# EAGLE design inputsheild_7 (EAGLE 9.3.0)
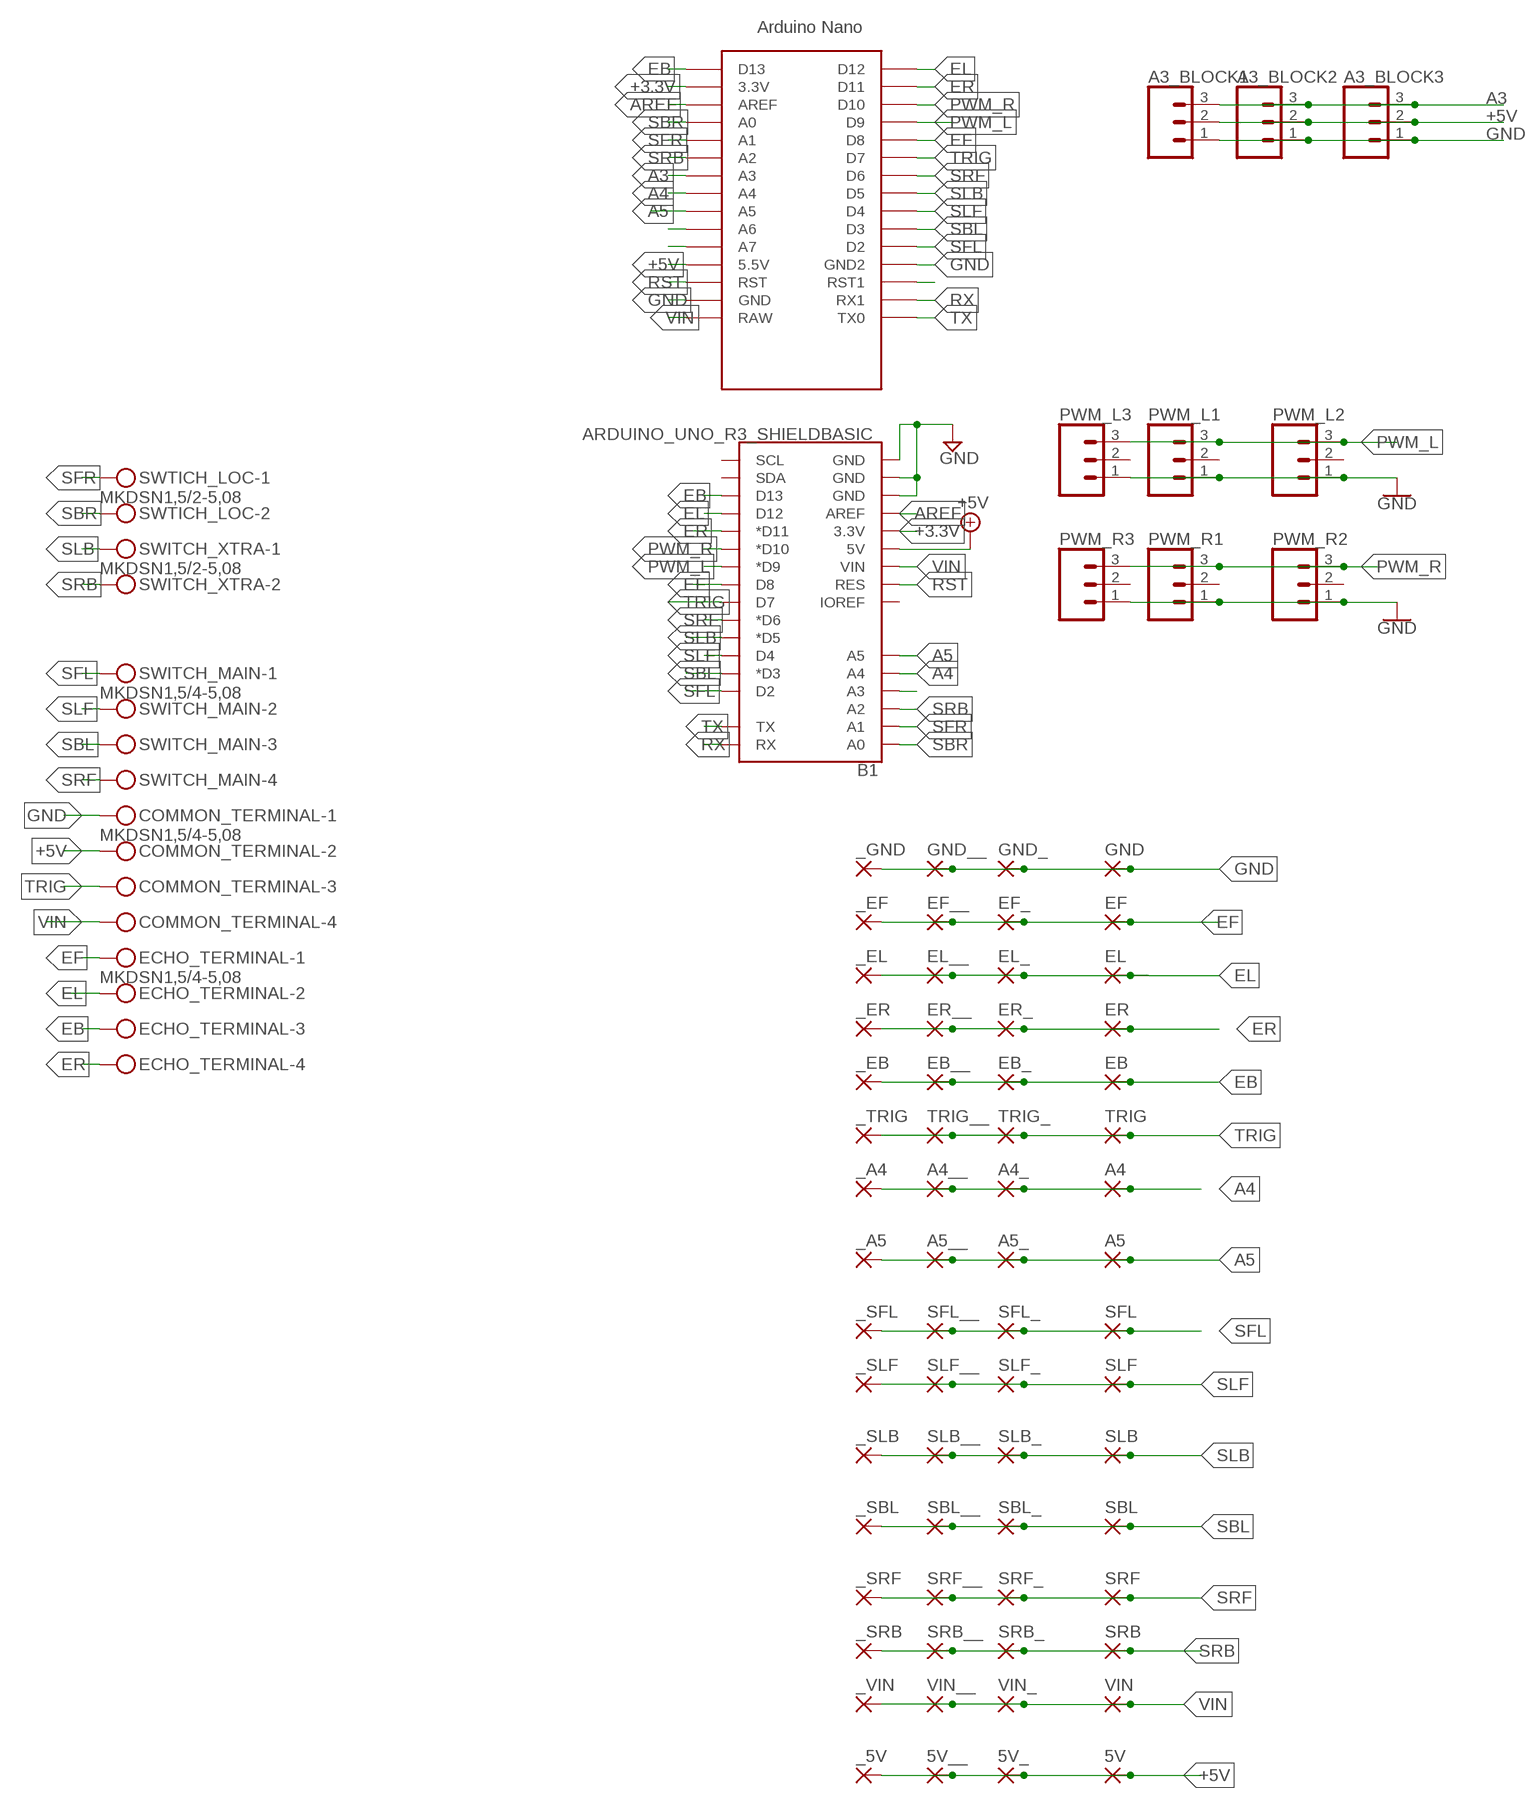
[diagram p0: schematic, sheet 1]

## Parts
5V  SMD5  [SMD2,54-5,08]
5V_  SMD5  [SMD2,54-5,08]
5V__  SMD5  [SMD2,54-5,08]
_5V  SMD5  [SMD2,54-5,08]
_A4  SMD5  [SMD2,54-5,08]
_A5  SMD5  [SMD2,54-5,08]
_EB  SMD5  [SMD2,54-5,08]
_EF  SMD5  [SMD2,54-5,08]
_EL  SMD5  [SMD2,54-5,08]
_ER  SMD5  [SMD2,54-5,08]
_GND  SMD5  [SMD2,54-5,08]
_SBL  SMD5  [SMD2,54-5,08]
_SFL  SMD5  [SMD2,54-5,08]
_SLB  SMD5  [SMD2,54-5,08]
_SLF  SMD5  [SMD2,54-5,08]
_SRB  SMD5  [SMD2,54-5,08]
_SRF  SMD5  [SMD2,54-5,08]
_TRIG  SMD5  [SMD2,54-5,08]
_VIN  SMD5  [SMD2,54-5,08]
A3_BLOCK1  CONN_03  [1X03]
A3_BLOCK2  CONN_03  [1X03]
A3_BLOCK3  CONN_03  [1X03]
A4  SMD5  [SMD2,54-5,08]
A4_  SMD5  [SMD2,54-5,08]
A4__  SMD5  [SMD2,54-5,08]
A5  SMD5  [SMD2,54-5,08]
A5_  SMD5  [SMD2,54-5,08]
A5__  SMD5  [SMD2,54-5,08]
B1  ARDUINO_UNO_R3_SHIELDBASIC  [UNO_R3_SHIELD]
COMMON_TERMINAL  MKDSN1,5/4-5,08  [MKDSN1,5/4-5,08]
EB  SMD5  [SMD2,54-5,08]
EB_  SMD5  [SMD2,54-5,08]
EB__  SMD5  [SMD2,54-5,08]
ECHO_TERMINAL  MKDSN1,5/4-5,08  [MKDSN1,5/4-5,08]
EF  SMD5  [SMD2,54-5,08]
EF_  SMD5  [SMD2,54-5,08]
EF__  SMD5  [SMD2,54-5,08]
EL  SMD5  [SMD2,54-5,08]
EL_  SMD5  [SMD2,54-5,08]
EL__  SMD5  [SMD2,54-5,08]
ER  SMD5  [SMD2,54-5,08]
ER_  SMD5  [SMD2,54-5,08]
ER__  SMD5  [SMD2,54-5,08]
GND  SMD5  [SMD2,54-5,08]
GND_  SMD5  [SMD2,54-5,08]
GND__  SMD5  [SMD2,54-5,08]
PWM_L1  CONN_03  [1X03]
PWM_L2  CONN_03  [1X03]
PWM_L3  CONN_03  [1X03]
PWM_R1  CONN_03  [1X03]
PWM_R2  CONN_03  [1X03]
PWM_R3  CONN_03  [1X03]
SBL  SMD5  [SMD2,54-5,08]
SBL_  SMD5  [SMD2,54-5,08]
SBL__  SMD5  [SMD2,54-5,08]
SFL  SMD5  [SMD2,54-5,08]
SFL_  SMD5  [SMD2,54-5,08]
SFL__  SMD5  [SMD2,54-5,08]
SLB  SMD5  [SMD2,54-5,08]
SLB_  SMD5  [SMD2,54-5,08]
SLB__  SMD5  [SMD2,54-5,08]
SLF  SMD5  [SMD2,54-5,08]
SLF_  SMD5  [SMD2,54-5,08]
SLF__  SMD5  [SMD2,54-5,08]
SRB  SMD5  [SMD2,54-5,08]
SRB_  SMD5  [SMD2,54-5,08]
SRB__  SMD5  [SMD2,54-5,08]
SRF  SMD5  [SMD2,54-5,08]
SRF_  SMD5  [SMD2,54-5,08]
SRF__  SMD5  [SMD2,54-5,08]
SWITCH_MAIN  MKDSN1,5/4-5,08  [MKDSN1,5/4-5,08]
SWITCH_XTRA  MKDSN1,5/2-5,08  [MKDSN1,5/2-5,08]
SWTICH_LOC  MKDSN1,5/2-5,08  [MKDSN1,5/2-5,08]
TRIG  SMD5  [SMD2,54-5,08]
TRIG_  SMD5  [SMD2,54-5,08]
TRIG__  SMD5  [SMD2,54-5,08]
U$1  NANO  [NANO]
VIN  SMD5  [SMD2,54-5,08]
VIN_  SMD5  [SMD2,54-5,08]
VIN__  SMD5  [SMD2,54-5,08]

## Nets
+3.3V: B1.3.3V U$1.3.3V
+5V: 5V.1(P) 5V_.1(P) 5V__.1(P) _5V.1(P) A3_BLOCK1.2 A3_BLOCK2.2 A3_BLOCK3.2 B1.5V COMMON_TERMINAL.2 U$1.5V(5.5V)
A3: A3_BLOCK1.3 A3_BLOCK2.3 A3_BLOCK3.3 U$1.A3
A4: _A4.1(P) A4.1(P) A4_.1(P) A4__.1(P) B1.A4 U$1.A4
A5: _A5.1(P) A5.1(P) A5_.1(P) A5__.1(P) B1.A5 U$1.A5
AREF: B1.AREF U$1.AREF
EB: _EB.1(P) B1.D13 EB.1(P) EB_.1(P) EB__.1(P) ECHO_TERMINAL.3 U$1.D13
EF: _EF.1(P) B1.D8 ECHO_TERMINAL.1 EF.1(P) EF_.1(P) EF__.1(P) U$1.D8
EL: _EL.1(P) B1.D12 ECHO_TERMINAL.2 EL.1(P) EL_.1(P) EL__.1(P) U$1.D12
ER: _ER.1(P) B1.D11(*D11) ECHO_TERMINAL.4 ER.1(P) ER_.1(P) ER__.1(P) U$1.D11
GND: _GND.1(P) A3_BLOCK1.1 A3_BLOCK2.1 A3_BLOCK3.1 B1.GND@0(GND) B1.GND@1(GND) B1.GND@2(GND) COMMON_TERMINAL.1 GND.1(P) GND_.1(P) GND__.1(P) PWM_L1.1 PWM_L2.1 PWM_L3.1 PWM_R1.1 PWM_R2.1 PWM_R3.1 U$1.GND U$1.GND1(GND2)
N$1: B1.A3
N$11: U$1.A6
N$12: U$1.A7
N$21: U$1.RST1
PWM_L: B1.D9(*D9) PWM_L1.3 PWM_L2.3 PWM_L3.3 U$1.D9
PWM_R: B1.D10(*D10) PWM_R1.3 PWM_R2.3 PWM_R3.3 U$1.D10
RST: B1.RES U$1.RST
RX: B1.RX U$1.RX1
SBL: _SBL.1(P) B1.D3(*D3) SBL.1(P) SBL_.1(P) SBL__.1(P) SWITCH_MAIN.3 U$1.D3
SBR: B1.A0 SWTICH_LOC.2 U$1.A0
SFL: _SFL.1(P) B1.D2 SFL.1(P) SFL_.1(P) SFL__.1(P) SWITCH_MAIN.1 U$1.D2
SFR: B1.A1 SWTICH_LOC.1 U$1.A1
SLB: _SLB.1(P) B1.D5(*D5) SLB.1(P) SLB_.1(P) SLB__.1(P) SWITCH_XTRA.1 U$1.D5
SLF: _SLF.1(P) B1.D4 SLF.1(P) SLF_.1(P) SLF__.1(P) SWITCH_MAIN.2 U$1.D4
SRB: _SRB.1(P) B1.A2 SRB.1(P) SRB_.1(P) SRB__.1(P) SWITCH_XTRA.2 U$1.A2
SRF: _SRF.1(P) B1.D6(*D6) SRF.1(P) SRF_.1(P) SRF__.1(P) SWITCH_MAIN.4 U$1.D6
TRIG: _TRIG.1(P) B1.D7 COMMON_TERMINAL.3 TRIG.1(P) TRIG_.1(P) TRIG__.1(P) U$1.D7
TX: B1.TX U$1.TX0
VIN: _VIN.1(P) B1.VIN COMMON_TERMINAL.4 U$1.RAW VIN.1(P) VIN_.1(P) VIN__.1(P)
Unconnected: B1.IOREF B1.SCL B1.SDA PWM_L1.2 PWM_L2.2 PWM_L3.2 PWM_R1.2 PWM_R2.2 PWM_R3.2 U$1.ICSP1 U$1.ICSP2 U$1.ICSP3 U$1.ICSP4 U$1.ICSP5 U$1.ICSP6

## Library data of the parts
5V 5V_ 5V__ _5V _A4 _A5 _EB _EF _EL _ER _GND _SBL _SFL _SLB _SLF _SRB _SRF _TRIG _VIN A4 A4_ A4__ A5 A5_ A5__ EB EB_ EB__ EF EF_ EF__ EL EL_ EL__ ER ER_ ER__ GND GND_ GND__ SBL SBL_ SBL__ SFL SFL_ SFL__ SLB SLB_ SLB__ SLF SLF_ SLF__ SRB SRB_ SRB__ SRF SRF_ SRF__ TRIG TRIG_ TRIG__ VIN VIN_ VIN__ = wirepad:SMD5: SMD PAD
A3_BLOCK1-A3_BLOCK3 PWM_L1-PWM_L3 PWM_R1-PWM_R3 = SparkFun-Connectors:CONN_03: Multi connection point. Often used as Generic Header-pin footprint for 0.1 inch spaced/style header connections On any of the 0.1 inch spaced packages, you can populate with these: Break Away Headers - Straight <https://www.sparkfun.com/products/116> (PRT-00116) Break Away Male Headers - Right Angle <https://www.sparkfun.com/products/553> (PRT-00553) Female Headers <https://www.sparkfun.com/products/115> (PRT-00115) Break Away Headers - Machine Pin <https://www.sparkfun.com/products/117> (PRT-00117) Break Away Female Headers - Swiss Machine Pin <https://www.sparkfun.com/products/743> (PRT-00743) Stackable Header - 3 Pin (Female, 0.1") <https://www.sparkfun.com/products/13875> (PRT-13875) For SCREWTERMINALS and SPRING TERMINALS visit here: Screw Terimnals on SparkFun.com <https://www.sparkfun.com/search/results?term=Screw+Terminals> (5mm/3.5mm/2.54mm spacing) This device is also useful as a general connection point to wire up your design to another part of your project. Our various solder wires solder well into these plated through hole pads. Hook-Up Wire - Assortment (Stranded, 22 AWG) <https://www.sparkfun.com/products/11375> (PRT-11375) Hook-Up Wire - Assortment (Solid Core, 22 AWG) <https://www.sparkfun.com/products/11367> (PRT-11367) View the entire wire category on our website here <https://www.sparkfun.com/categories/141> Special notes: Molex polarized connector foot print use with SKU : PRT-08232 with associated crimp pins and housings.
B1 = SparkFun-Boards:ARDUINO_UNO_R3_SHIELD: Arduino R3 Shield Footprint Shield form compatible with the Arduino Uno R3. SparkFun Products: MG2639 Cellular Shield <https://www.sparkfun.com/products/13120> MIDI Shield <https://www.sparkfun.com/products/12898> R3 Stackable Headers Kit <https://www.sparkfun.com/products/11417>
COMMON_TERMINAL ECHO_TERMINAL SWITCH_MAIN = con-phoenix-508:MKDSN1,5/4-5,08: MKDSN 1,5/ 4-5,08 Printklemme Nennstrom: 13,5 A Nennspannung: 250 V Rastermaß: 5,08 mm Polzahl: 4 Anschlussart: Schraubanschluss Montage: Löten Anschlussrichtung Leiter/Platine: 0 ° Artikelnummer: 1729144 Source: http://eshop.phoenixcontact.com .. 1729144.pdf
SWITCH_XTRA SWTICH_LOC = con-phoenix-508:MKDSN1,5/2-5,08: MKDSN 1,5/ 2-5,08 Printklemme Nennstrom: 13,5 A Nennspannung: 250 V Rastermaß: 5,08 mm Polzahl: 2 Anschlussart: Schraubanschluss Montage: Löten Anschlussrichtung Leiter/Platine: 0 ° Artikelnummer: 1729128 Source: http://eshop.phoenixcontact.com .. 1729128.pdf
U$1 = Arduino-clone:NANO: Arduino Nano

## Board
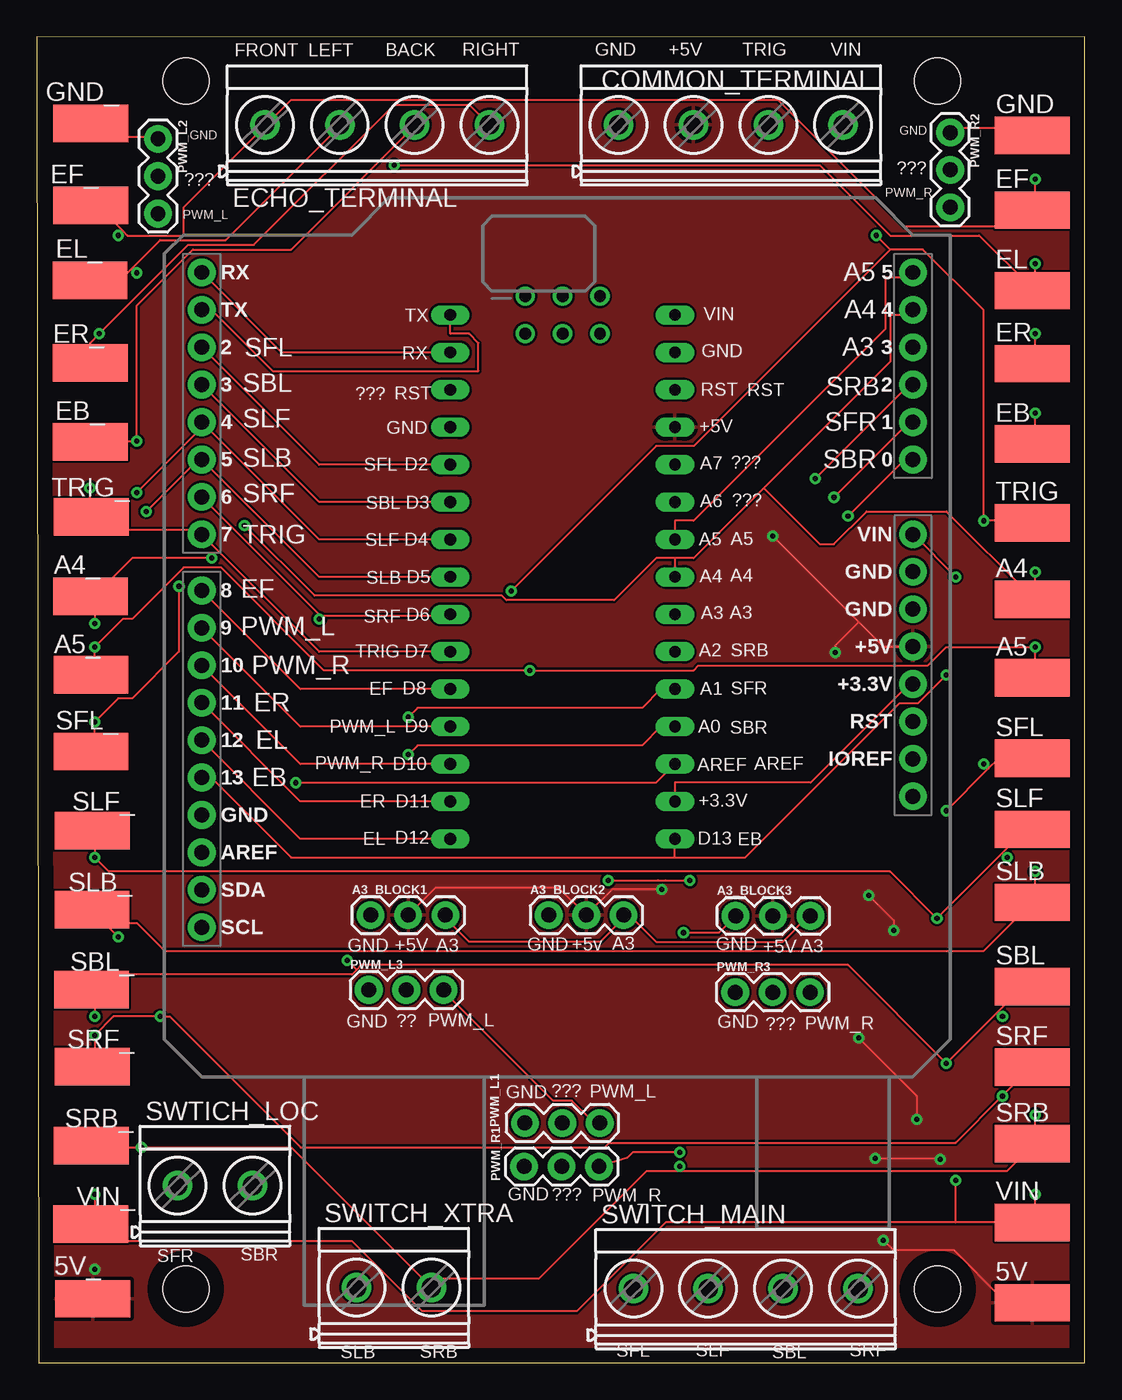
[diagram p1: board, top side]
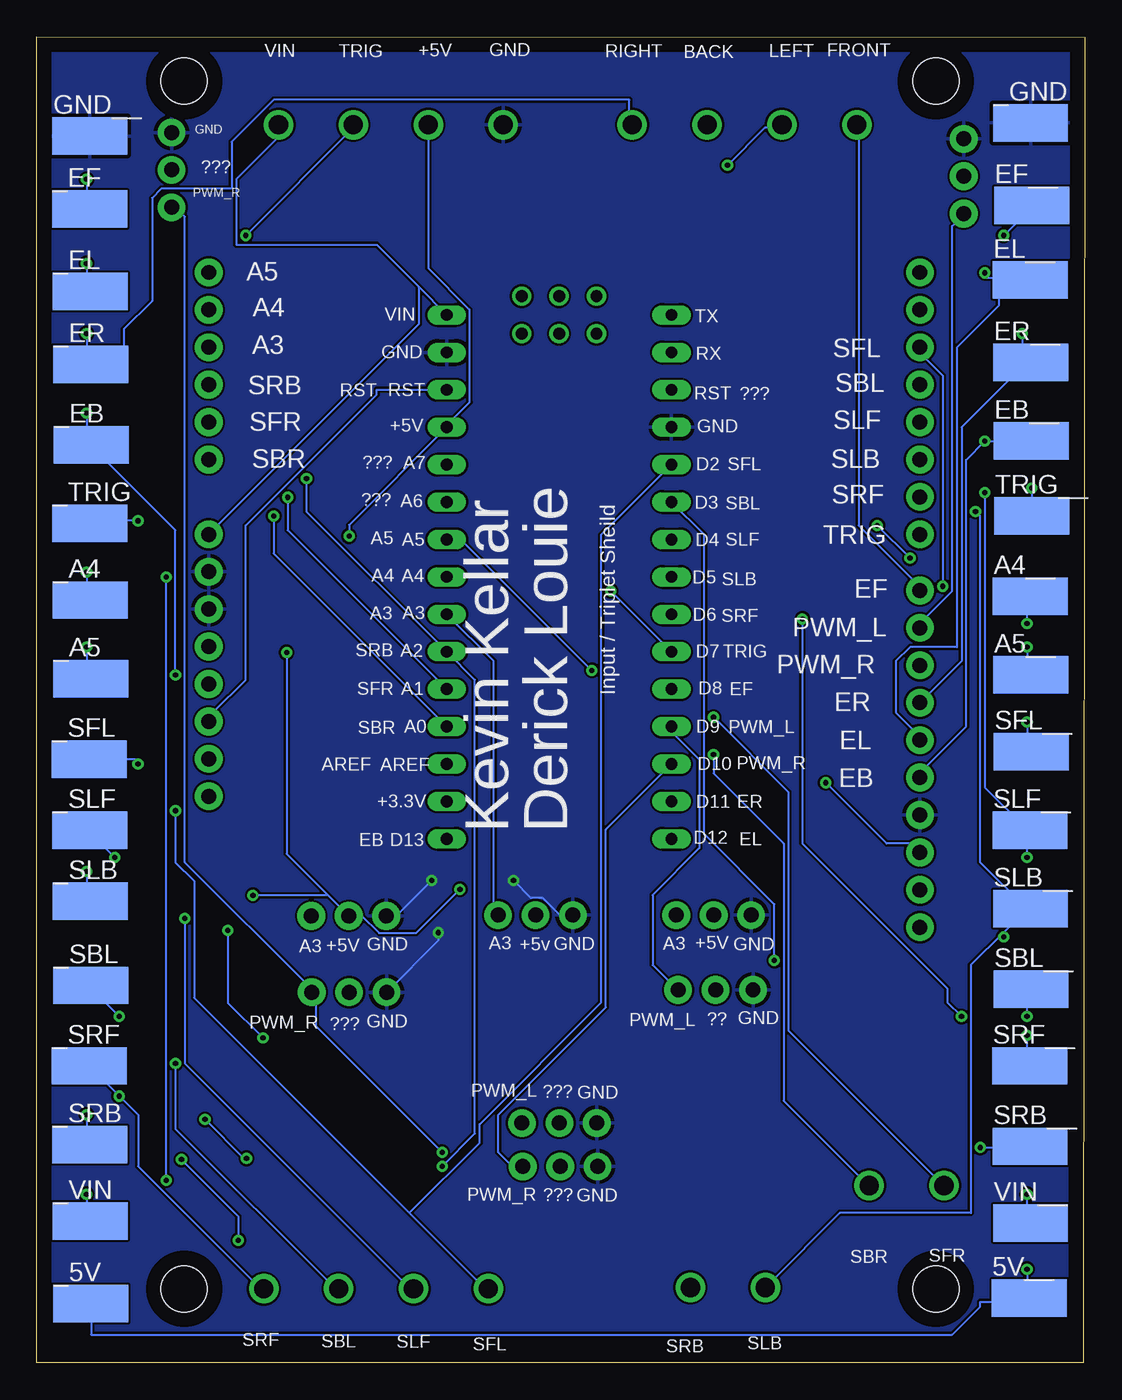
[diagram p2: board, bottom side, seen from below]

Size 71.12 x 90 mm. Coordinates in mm from the lower left corner, seen from the top.
Outline: 0.12,0 71.12,0 71.12,90 0,89.98 0.12,0
Copper layers (1*16): Top 0.035mm / dielectric 1.5mm / Bottom 0.035mm
Design rules "default": minimum track width 6mil, minimum drill 0.35mm, track to track 6mil, track to pad 6mil, pad to pad 6mil, via to via 6mil, smd to smd 6mil, copper to edge 40mil, drill to drill 6mil, minimum pad ring 10mil, minimum via ring 8mil, stop-mask expansion 4mil, vias tented up to drill 0mil, thermal gap 10mil
Holes 3.12 mm at 10.12,87 61.12,87 61.12,5 10.12,5

### Footprints (pad centres in the part's own frame; a part is rotated, then mirrored left to right if it is on the bottom)
SMD2,54-5,08 = smd 2.54 x 5.08: 1 0,0
1X03 = drill 1.016 pad 1.88: 1 0,0; 2 2.54,0; 3 5.08,0
UNO_R3_SHIELD = drill 1.016 pad 1.88: 3.3V 24.13,-2.54; 5V 24.13,0; A0 24.13,12.7; A1 24.13,15.24; A2 24.13,17.78; A3 24.13,20.32; A4 24.13,22.86; A5 24.13,25.4; AREF -24.13,-13.97; D2 -24.13,20.32; D3 -24.13,17.78; D4 -24.13,15.24; D5 -24.13,12.7; D6 -24.13,10.16; D7 -24.13,7.62; D8 -24.13,3.81; D9 -24.13,1.27; D10 -24.13,-1.27; D11 -24.13,-3.81; D12 -24.13,-6.35; D13 -24.13,-8.89; GND@0 24.13,2.54; GND@1 24.13,5.08; GND@2 -24.13,-11.43; IOREF 24.13,-7.62; NC 24.13,-10.16; RES 24.13,-5.08; RX -24.13,25.4; SCL -24.13,-19.05; SDA -24.13,-16.51; TX -24.13,22.86; VIN 24.13,7.62
MKDSN1,5/4-5,08 = drill 1.3 pad 2: 1 -7.641,0.025; 2 -2.561,0.025; 3 2.519,0.025; 4 7.599,0.025
MKDSN1,5/2-5,08 = drill 1.3 pad 2: 1 -2.561,0.025; 2 2.519,0.025
NANO = drill 0.8 long: 3.3V -10.16,24.13; 5V -10.16,-1.27; A0 -10.16,19.05; A1 -10.16,16.51; A2 -10.16,13.97; A3 -10.16,11.43; A4 -10.16,8.89; A5 -10.16,6.35; A6 -10.16,3.81; A7 -10.16,1.27; AREF -10.16,21.59; D2 5.08,1.27; D3 5.08,3.81; D4 5.08,6.35; D5 5.08,8.89; D6 5.08,11.43; D7 5.08,13.97; D8 5.08,16.51; D9 5.08,19.05; D10 5.08,21.59; D11 5.08,24.13; D12 5.08,26.67; D13 -10.16,26.67; GND -10.16,-6.35; GND1 5.08,-1.27; RAW -10.16,-8.89; RST -10.16,-3.81; RST1 5.08,-3.81; RX1 5.08,-6.35; TX0 5.08,-8.89 | drill 0.8: ICSP1 -5.08,-10.16; ICSP2 -5.08,-7.62; ICSP3 -2.54,-10.16; ICSP4 -2.54,-7.62; ICSP5 0,-10.16; ICSP6 0,-7.62

### Placement (x,y rotation side)
5V  67.55,4.06 270 top
5V_  3.78,4.34 90 top
5V__  3.78,4.4 270 bottom
_5V  67.46,4.02 270 bottom
_A4  67.5,51.77 270 bottom
_A5  67.47,46.44 270 bottom
_EB  67.44,62.31 270 bottom
_EF  67.54,78.31 270 bottom
_EL  67.5,72.72 270 bottom
_ER  67.47,67.77 270 bottom
_GND  3.69,84.16 270 bottom
_SBL  67.46,25.61 270 bottom
_SFL  67.56,40.98 270 bottom
_SLB  67.49,31.32 270 bottom
_SLF  67.53,36.15 270 bottom
_SRB  67.52,14.81 270 bottom
_SRF  67.55,20.15 270 bottom
_TRIG  67.53,56.98 270 bottom
_VIN  67.49,9.61 270 bottom
A3_BLOCK1  22.65,30.38 0 top
A3_BLOCK2  34.74,30.38 0 top
A3_BLOCK3  47.41,30.33 0 top
A4  67.55,51.82 270 top
A4_  3.64,52.04 270 top
A4__  3.7,52.02 270 bottom
A5  67.55,46.48 270 top
A5_  3.67,46.7 270 top
A5__  3.66,46.69 270 bottom
B1  35.32,48.61 0 top
COMMON_TERMINAL  47.12,84 0 top
EB  67.55,62.36 270 top
EB_  3.62,62.51 270 top
EB__  3.64,62.56 270 bottom
ECHO_TERMINAL  23.12,84 0 top
EF  67.55,78.23 270 top
EF_  3.67,78.55 90 top
EF__  3.61,78.57 270 bottom
EL  67.55,72.77 270 top
EL_  3.6,73.46 270 top
EL__  3.7,73.49 270 bottom
ER  67.55,67.82 270 top
ER_  3.62,67.87 270 top
ER__  3.67,67.9 270 bottom
GND  67.55,83.31 270 top
GND_  3.65,84.12 90 top
GND__  67.52,83.27 270 bottom
PWM_L1  33.12,16.27 0 top
PWM_L2  8.22,83.07 270 top
PWM_L3  22.52,25.3 0 top
PWM_R1  33.07,13.32 0 top
PWM_R2  61.97,83.51 270 top
PWM_R3  47.39,25.15 0 top
SBL  67.55,25.53 270 top
SBL_  3.71,25.33 90 top
SBL__  3.66,25.35 270 bottom
SFL  67.55,41.02 270 top
SFL_  3.67,41.49 90 top
SFL__  3.63,41.48 270 bottom
SLB  67.55,31.24 270 top
SLB_  3.75,30.76 90 top
SLB__  3.69,30.82 270 bottom
SLF  67.55,36.2 270 top
SLF_  3.75,36.11 90 top
SLF__  3.73,36.15 270 bottom
SRB  67.55,14.86 270 top
SRB_  3.69,14.72 90 top
SRB__  3.72,14.69 270 bottom
SRF  67.55,20.07 270 top
SRF_  3.75,20.09 90 top
SRF__  3.75,20.15 270 bottom
SWITCH_MAIN  48.12,5 0 top
SWITCH_XTRA  24.25,5.08 0 top
SWTICH_LOC  12.12,12 0 top
TRIG  67.55,57.02 270 top
TRIG_  3.68,57.42 270 top
TRIG__  3.6,57.48 270 bottom
U$1  33.14,62.23 180 top
VIN  67.55,9.53 270 top
VIN_  3.67,9.39 90 top
VIN__  3.69,9.48 270 bottom

### Tracks (layer width: path | path; a pad name or v marks a point on that pad's centre or on a via)
+3.3V
  Top 0.152: U$1.3.3V 43.3,39.37 52.51,39.37 59.17,46.04 B1.3.3V
+5V  (via drill 0.35)
  Top 0.152: v49.93,56.11 55.77,50.27 | 55.77,50.27 57.43,48.61 B1.5V | 55.77,50.27 54.17,48.67 v54.17,48.21 | v42.41,32.13 39.03,32.13 A3_BLOCK2.2 35.42,32.23 27.04,32.23 A3_BLOCK1.2 | v56.45,31.73 58.16,30.02 v58.16,29.34 58.16,29.03 | v55.77,22.05 59.71,18.11 v59.71,16.51 | v56.89,13.87 61.23,13.87 v61.31,13.79 | v57.45,8.31 58.1,7.66 62.22,7.66 65.45,4.42
  Bottom 0.152: v3.93,6.35 3.93,4.45 5V__.1 3.93,4.13 7.1,4.13 7.1,3.81 9.01,1.91 67.43,1.91 67.43,3.81 _5V.1 | COMMON_TERMINAL.2 44.56,74.28 41.76,71.49 41.76,65.22 41.75,65.2 43.3,63.65 U$1.5V 49.93,56.87 v49.93,56.11 | v54.17,48.21 54.17,34.54 A3_BLOCK3.2 | A3_BLOCK3.2 49.06,30.33 47.9,29.16 45.38,29.16 v42.41,32.13 | A3_BLOCK3.2 51.35,31.73 v56.45,31.73 | v58.16,29.34 58.16,24.43 v55.77,22.05 | v59.71,16.51 57.06,13.87 v56.89,13.87 | v61.31,13.79 57.45,9.93 v57.45,8.31
  pour Top: 0.12,90 71.12,90 71.12,0 0.12,0
A3
  Top 0.152: A3_BLOCK3.3 52.19,30.16 50.6,28.57 42.03,28.57 40.44,30.16 40.12,30.16 A3_BLOCK2.3 39.81,30.16 38.22,28.57 29.33,28.57 27.74,30.16 A3_BLOCK1.3
  Bottom 0.152: U$1.A3 40.12,47.62 40.12,30.48 A3_BLOCK2.3
A4  (via drill 0.35)
  Top 0.152: v67.74,53.66 67.74,52.07 A4.1 67.43,52.07 61.71,57.78 56.31,57.78 54.09,55.56 53.14,55.56 49.33,59.37 | v3.93,50.16 3.93,51.75 A4_.1 3.93,52.07 6.47,54.61 v11.87,54.61 | 43.3,54.61 U$1.A4 | 43.3,54.61 44.57,54.61 49.33,59.37 | 49.33,59.37 57.9,67.94 57.9,71.12 58.85,71.12 59.17,71.44 B1.A4 | v14.09,56.83 18.85,52.07 31.55,52.07 31.87,51.75 39.17,51.75 42.03,54.61 43.3,54.61
  Bottom 0.152: v67.74,53.66 67.74,52.07 _A4.1 | v3.93,50.16 3.93,51.75 A4__.1 | v14.09,56.83 v11.87,54.61
A5  (via drill 0.35)
  Top 0.152: A5.1 67.74,46.67 v67.74,48.58 61.71,48.58 60.44,47.31 44.88,47.31 44.57,46.99 v33.45,46.99 19.48,46.99 12.5,53.98 9.96,53.98 6.47,50.48 5.83,50.48 v3.93,48.58 3.93,46.99 A5_.1 | U$1.A5 43.3,57.15 44.57,57.15 57.59,70.17 57.59,73.66 58.85,73.66 59.17,73.98 B1.A5
  Bottom 0.152: v67.74,48.58 67.74,46.67 _A5.1 | v3.93,48.58 3.93,46.99 A5__.1 | v33.45,46.99 42.34,55.88 U$1.A5
AREF  (via drill 0.35)
  Top 0.152: U$1.AREF 42.03,39.37 v17.58,39.37
  Bottom 0.152: v17.58,39.37 13.45,35.24 11.23,35.24 11.23,34.92 B1.AREF
EB  (via drill 0.35)
  Top 0.152: ECHO_TERMINAL.3 25.52,83.82 17.26,75.56 10.59,75.56 6.79,71.75 v6.79,62.55 3.93,62.55 EB_.1 | v67.74,64.45 67.74,62.55 EB.1 | 43.3,34.29 U$1.D13 | 43.3,34.29 17.26,34.29 11.87,39.69 11.23,39.69 B1.D13 | v61.71,46.67 59.81,44.77 58.54,44.77 48.06,34.29 43.3,34.29
  Bottom 0.152: EB__.1 3.93,62.55 v6.79,62.55 8.06,61.28 8.06,43.18 10.91,40.32 10.91,40.01 B1.D13 | v67.74,64.45 67.74,62.55 _EB.1 67.43,62.23 61.71,56.52 v61.71,46.67
EF  (via drill 0.35)
  Top 0.152: U$1.D8 17.89,45.72 B1.D8 | v67.74,80.33 67.74,78.42 EF.1 66.48,77.15 58.85,77.15 50.28,85.72 17.26,85.72 15.67,84.14 ECHO_TERMINAL.1 15.36,83.82 9.96,78.42 9.96,76.52 6.15,76.52 5.83,76.83 | 5.83,76.83 4.25,78.42 3.93,78.42 EF_.1 | 5.83,76.83 v5.51,76.52
  Bottom 0.152: v67.74,80.33 67.74,78.42 _EF.1 | v5.51,76.52 3.61,78.42 EF__.1 | B1.D8 11.23,52.7 15.36,56.83 15.36,83.82 ECHO_TERMINAL.1
EL  (via drill 0.35)
  Top 0.152: U$1.D12 17.89,35.56 B1.D12 | v67.74,74.61 67.74,73.03 EL.1 67.43,73.03 63.94,76.52 57.9,76.52 53.14,81.28 v24.25,81.28 | 6.47,74.3 5.83,73.66 3.61,73.66 EL_.1 | 6.47,74.3 8.37,76.2 12.82,76.2 20.44,83.82 ECHO_TERMINAL.2 | 6.47,74.3 v6.79,73.98
  Bottom 0.152: v67.74,74.61 67.74,73.03 _EL.1 | 5.83,73.66 6.79,73.66 v6.79,73.98 | 5.83,73.66 3.93,73.66 EL__.1 5.83,73.66 | v24.25,81.28 21.71,83.82 20.75,83.82 ECHO_TERMINAL.2 | 5.83,73.66 5.83,71.75 8.69,68.9 8.69,48.58 11.87,48.58 12.82,47.62 12.82,44.13 11.23,42.55 B1.D12
ER  (via drill 0.35)
  Top 0.152: U$1.D11 17.89,38.1 B1.D11 | v67.74,69.85 67.74,67.94 ER.1 | ECHO_TERMINAL.4 30.6,84.14 29.33,85.41 24.25,85.41 14.72,75.88 10.28,75.88 v4.25,69.85 3.61,69.22 3.61,67.94 ER_.1
  Bottom 0.152: v67.74,69.85 67.74,68.9 | 67.74,68.9 67.74,67.94 _ER.1 67.74,68.9 | 3.93,67.94 4.25,68.26 v4.25,69.85 | 67.74,68.9 65.21,68.9 65.21,70.17 63.3,72.07 63.3,79.06 62.66,79.69 57.9,79.69 57.9,82.87 55.05,85.72 30.91,85.72 30.91,84.14 ECHO_TERMINAL.4 | 3.93,67.94 8.37,63.5 8.37,47.62 10.91,45.09 B1.D11 | 3.93,67.94 ER__.1
GND  (via drill 0.35)
  Top 0.152: GND.1 67.43,83.5 67.11,83.82 62.03,83.82 PWM_R2.1 | GND_.1 3.93,83.82 4.56,83.19 8.06,83.19 PWM_L2.1 | v38.77,32.73 42.15,32.73 42.16,32.74 42.66,32.74 42.67,32.73 v44.31,32.73 | A3_BLOCK3.1 46.27,29.18 v43.88,29.18
  Bottom 0.152: v38.77,32.73 37.59,31.55 36.79,31.55 35.63,30.38 A3_BLOCK2.1 | v44.31,32.73 46.72,30.33 A3_BLOCK3.1 | v43.88,29.18 43.88,28.65 PWM_R3.1
  pour Bottom: 0.12,0 71.12,0 71.12,90 0.12,90
PWM_L
  Top 0.152: U$1.D9 17.89,43.18 B1.D9 | PWM_L3.3 27.74,25.08 35.04,17.78 36.31,17.78 37.58,16.51 37.9,16.51 PWM_L1.3
  Bottom 0.152: PWM_L2.3 8.37,77.79 9.01,77.15 9.01,52.39 10.91,50.48 10.91,50.16 B1.D9 | U$1.D9 28.06,42.86 26.15,40.96 26.15,34.92 29.33,31.75 29.33,26.99 27.74,25.4 PWM_L3.3
PWM_R  (via drill 0.35)
  Top 0.152: U$1.D10 17.89,40.64 B1.D10 | v43.62,14.29 40.44,14.29 40.06,13.91 PWM_R1.3
  Bottom 0.152: v43.62,14.29 52.19,22.86 52.19,25.08 PWM_R3.3 52.51,25.4 61.08,33.97 61.08,77.79 61.71,78.42 PWM_R2.3 | U$1.D10 32.5,36.2 32.5,24.13 39.81,16.83 39.81,14.29 38.22,12.7 38.15,12.72 PWM_R1.3
RST
  Bottom 0.152: U$1.RST 48.06,66.04 48.06,65.72 56.95,56.83 56.95,46.35 59.17,44.13 59.17,43.81 B1.RES
RX
  Top 0.152: U$1.RX1 16.62,68.58 B1.RX
SBL  (via drill 0.35)
  Top 0.152: U$1.D3 19.16,58.42 B1.D3 | v3.93,23.5 3.93,25.08 SBL_.1 3.93,25.4 4.88,26.35 21.39,26.35 21.71,26.67 | 65.21,23.81 66.79,25.4 67.43,25.4 SBL.1 | 65.21,23.81 v61.71,20.32 55.05,26.99 22.02,26.99 21.71,26.67 | 65.21,23.81 v65.52,23.5 | 21.71,26.67 v21.07,27.3
  Bottom 0.152: v3.93,23.5 3.93,25.08 SBL__.1 | v61.71,20.32 61.71,15.88 50.92,5.08 SWITCH_MAIN.3 | v65.52,23.5 67.43,25.4 _SBL.1 | U$1.D3 25.84,56.2 25.84,35.88 21.07,31.11 v21.07,27.3
SBR  (via drill 0.35)
  Top 0.152: v55.05,57.47 58.85,61.28 59.17,61.28 B1.A0 | v25.2,41.27 25.84,41.91 41.08,41.91 42.34,43.18 U$1.A0
  Bottom 0.152: U$1.A0 55.05,54.93 v55.05,57.47 | v25.2,41.27 25.2,40.01 20.44,35.24 20.44,17.78 14.72,12.06 SWTICH_LOC.2
SFL  (via drill 0.35)
  Top 0.152: U$1.D2 19.16,60.96 B1.D2 | SFL_.1 3.93,41.59 v3.93,43.5 5.51,45.09 6.47,45.09 9.64,48.26 v9.64,52.7 | 64.57,40.32 65.21,40.96 67.43,40.96 SFL.1 | 64.57,40.32 v61.71,37.47 | 64.57,40.32 v64.25,40.64
  Bottom 0.152: v3.93,43.5 3.93,41.59 SFL__.1 | v9.64,52.7 9.64,66.99 10.91,68.26 10.91,68.9 B1.D2 | 45.84,10.16 60.44,24.77 60.44,32.7 61.71,33.97 v61.71,37.47 | 45.84,10.16 40.76,5.08 SWITCH_MAIN.1 | v64.25,40.64 64.25,40.96 67.43,40.96 _SFL.1 | U$1.D2 32.82,56.2 32.82,24.45 41.08,16.19 41.08,14.92 45.84,10.16
SFR  (via drill 0.35)
  Top 0.152: v54.09,58.74 59.17,63.82 B1.A1 | v25.2,43.81 25.84,44.45 41.08,44.45 42.34,45.72 U$1.A1
  Bottom 0.152: U$1.A1 54.09,56.52 v54.09,58.74 | v25.2,43.81 20.12,38.73 20.12,22.54 9.64,12.06 SWTICH_LOC.1
SLB  (via drill 0.35)
  Top 0.152: U$1.D5 19.16,53.34 B1.D5 10.91,61.28 v7.42,57.78 | v67.74,33.34 67.74,31.43 SLB.1 64.25,27.94 8.69,27.94 6.79,29.84 4.56,29.84 | v5.51,28.89 4.56,29.84 | 4.56,29.84 3.93,30.48 SLB_.1 4.56,29.84
  Bottom 0.152: v67.74,33.34 67.74,31.43 _SLB.1 | 3.93,30.8 5.51,29.21 | 5.51,29.21 7.74,26.99 7.74,10.16 16.63,10.16 21.39,5.4 SWITCH_XTRA.1 | 5.51,29.21 v5.51,28.89 | v7.42,57.78 7.1,57.47 7.1,33.97 3.93,30.8 | 3.93,30.8 SLB__.1
SLF  (via drill 0.35)
  Top 0.152: U$1.D4 19.16,55.88 B1.D4 11.55,63.5 11.23,63.5 v6.79,59.05 | SLF_.1 3.93,35.88 v3.93,34.29 4.88,33.34 57.9,33.34 v61.08,30.16 65.52,34.61 | 65.52,34.61 67.11,36.2 SLF.1 | 65.52,34.61 v65.84,34.29
  Bottom 0.152: v3.93,34.29 3.93,35.88 SLF__.1 3.93,36.2 6.79,39.05 v6.79,59.05 | v61.08,30.16 61.08,20.32 45.84,5.08 SWITCH_MAIN.2 | v65.84,34.29 67.43,35.88 _SLF.1
SRB  (via drill 0.35)
  Top 0.152: v52.82,60.01 59.17,66.36 B1.A2 | v67.74,16.83 67.74,14.92 SRB.1 67.43,14.61 65.84,13.02 43.62,13.02 | 26.15,5.71 17.26,14.61 v7.1,14.61 3.93,14.61 SRB_.1 | 26.15,5.71 26.47,5.4 SWITCH_XTRA.2 26.15,5.71 | 43.62,13.02 41.39,13.02 34.09,5.71 26.15,5.71 | 43.62,13.02 v43.62,13.34
  Bottom 0.152: v52.82,60.01 52.82,57.78 U$1.A2 41.39,46.35 41.39,15.56 v43.62,13.34 | v67.74,16.83 67.74,14.92 _SRB.1 | v7.1,14.61 3.93,14.61 SRB__.1
SRF  (via drill 0.35)
  Top 0.152: U$1.D6 27.93,50.67 19.29,50.67 19.16,50.8 | 19.16,50.8 B1.D6 | SRF.1 67.43,20 v65.52,18.1 62.35,14.92 38.85,14.92 38.53,14.61 17.9,14.61 9.01,23.5 v8.37,23.5 5.2,23.5 v3.93,22.23 3.93,20.32 SRF_.1 | v19.17,50.48 19.17,50.8 19.16,50.8
  Bottom 0.152: SWITCH_MAIN.4 56,5.08 64.25,13.34 64.25,16.83 v65.52,18.1 67.43,20 _SRF.1 | v3.93,22.23 3.93,20.32 SRF__.1 | v8.37,23.5 9.32,24.45 9.32,25.4 19.17,35.24 v19.17,50.48
TRIG  (via drill 0.35)
  Top 0.152: U$1.D7 19.16,48.26 B1.D7 10.91,56.52 4.56,56.52 3.93,57.15 TRIG_.1 3.61,57.47 v3.61,59.37 | 57.9,75.56 v56.95,76.52 | 57.9,75.56 60.13,75.56 64.25,71.44 v64.25,57.15 67.43,57.15 TRIG.1 | v32.19,52.39 42.03,62.23 44.57,62.23 57.9,75.56
  Bottom 0.152: v3.61,59.37 3.61,57.78 TRIG__.1 | v56.95,76.52 49.65,83.82 COMMON_TERMINAL.3 | v64.25,57.15 67.43,57.15 _TRIG.1 | v32.19,52.39 U$1.D7
TX
  Top 0.152: U$1.TX0 28.06,69.85 29.33,69.85 29.96,69.22 29.96,67.31 15.99,67.31 11.87,71.44 11.23,71.44 B1.TX
VIN  (via drill 0.35)
  Top 0.152: v3.93,11.43 3.93,9.53 VIN_.1 3.93,9.21 4.88,8.26 21.39,8.26 26.15,3.49 36.63,3.49 42.66,9.53 62.35,9.53 | v67.74,11.43 67.74,9.53 VIN.1 62.35,9.53 | v62.35,53.34 59.49,56.2 B1.VIN | 62.35,9.53 v62.35,12.38
  Bottom 0.152: 45.2,73.03 48.06,75.88 57.59,75.88 57.59,80.33 54.73,83.19 54.73,83.82 COMMON_TERMINAL.4 | 45.2,73.03 U$1.RAW | 45.2,73.03 45.2,70.48 59.17,56.52 B1.VIN | v3.93,11.43 3.93,9.53 VIN__.1 | v67.74,11.43 67.74,9.84 _VIN.1 | v62.35,12.38 v62.35,53.34

### Text on the board
tNames: FRONT | LEFT | BACK | RIGHT | GND | +5V | TRIG | VIN | GND | GND | ??? | ??? | PWM_R | PWM_L | A5 | TX | VIN | A4 | SFL | RX | GND | A3 | SBL | RST | RST | SRB | ??? | RST | SLF | GND | +5V | SFR | SLB | SFL | D2 | A7 | ??? | SBR | SRF | SBL | D3 | A6 | ??? | TRIG | SLF | D4 | A5 | A5 | SLB | D5 | A4 | A4 | EF | SRF | D6 | A3 | A3 | PWM_L | TRIG | D7 | A2 | SRB | PWM_R | EF | D8 | A1 | SFR | ER | PWM_L | D9 | A0 | SBR | EL | EL | PWM_R | D10 | AREF | AREF | EB | ER | D11 | +3.3V | EL | D12 | D13 | EB | GND | +5V | A3 | GND | +5v | A3 | GND | +5V | A3 | GND | ?? | PWM_L | GND | ??? | PWM_R | GND | ??? | PWM_L | GND | ??? | PWM_R | SFR | SBR | SLB | SRB | SFL | SLF | SBL | SRF
bNames: FRONT | LEFT | BACK | RIGHT | GND | +5V | TRIG | VIN | GND | ??? | PWM_R | A5 | TX | VIN | A4 | SFL | RX | GND | A3 | SBL | RST | RST | SRB | ??? | RST | SLF | GND | +5V | SFR | SLB | SFL | D2 | A7 | ??? | SBR | SRF | SBL | D3 | A6 | ??? | TRIG | A5 | SLF | D4 | A5 | SLB | D5 | A4 | A4 | EF | SRF | D6 | A3 | A3 | PWM_L | TRIG | D7 | A2 | SRB | PWM_R | EF | D8 | Input / Triplet Sheild | A1 | SFR | ER | PWM_L | D9 | A0 | SBR | EL | PWM_R | D10 | AREF | AREF | EB | ER | D11 | +3.3V | Derick Louie | Kevin Kellar | EL | D12 | D13 | EB | GND | +5V | A3 | GND | +5v | A3 | GND | +5V | A3 | GND | ?? | PWM_L | GND | ??? | PWM_R | GND | ??? | PWM_L | GND | ??? | PWM_R | SFR | SBR | SLB | SRB | SFL | SLF | SBL | SRF